# Altium project PCB_Project_1.3.PrjPcb
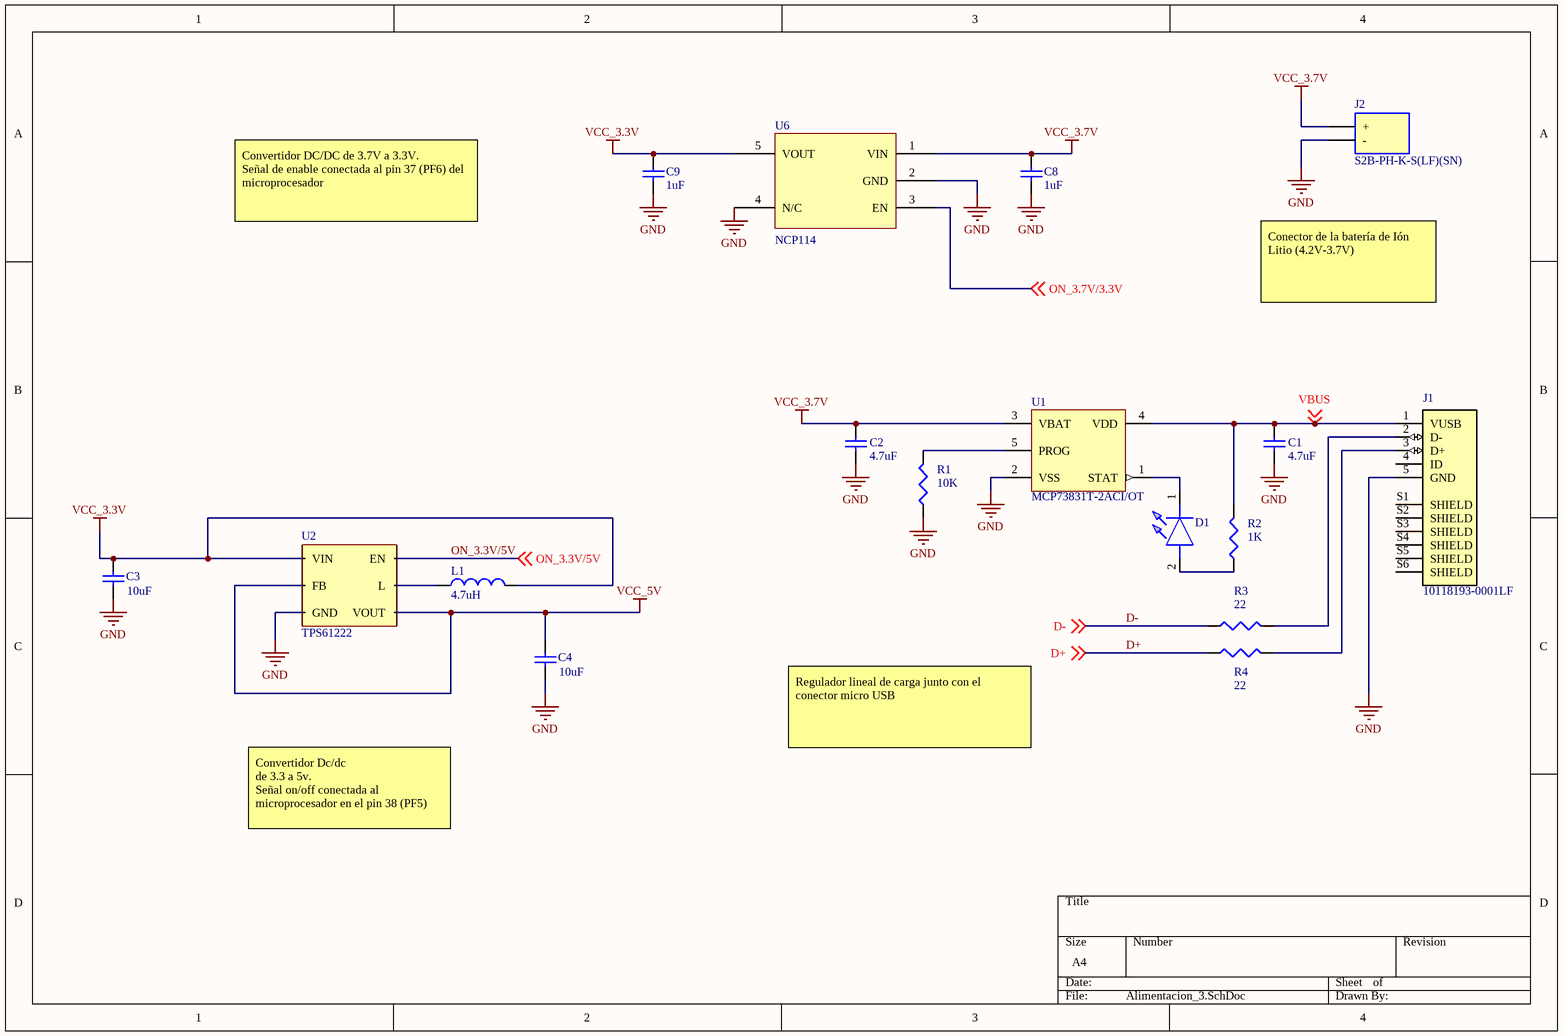
[diagram p0: Alimentacion_3.SchDoc]
3 sheets, 43 parts. Net scope: global (net labels, ports and power ports of the same name join across sheets).
Board file: Bicimaps_3.PcbDoc
Sheets:
  Alimentacion_3.SchDoc
  Procesador_3.SchDoc
  Sensores_3.SchDoc

## Sheet Alimentacion_3.SchDoc
size A4

### Parts
C1  value 4.7uF  [0603]  (hidden comment: Cap)
C2  value 4.7uF  [0603]  (hidden comment: Cap)
C3  value 10uF  [0603]  (hidden comment: Cap)
C4  value 10uF  [0603]  (hidden comment: Cap)
C8  value 1uF  [0603]  (hidden comment: Cap)
C9  value 1uF  [0603]  (hidden comment: Cap)
D1  150060GS75000  [LEDC1608X80N]  (value not drawn)
J1  10118193-0001LF  [FCI_10118193-0001LF_10118193-0001LF(Primary)]
J2  S2B-PH-K-S(LF)(SN)  [S2B_Lipo_Header]
L1  value 4.7uH  [0603]  (hidden comment: Inductor)
R1  value 10K  [0603]  (hidden comment: Res3)
R2  value 1K  [0603]  (hidden comment: Res3)
R3  value 22  [0603]  (hidden comment: Res3)
R4  value 22  [0603]  (hidden comment: Res3)
U1  MCP73831T-2ACI/OT  [SOT-23-OT5_N]
U2  TPS61222  [TPS61222DCK]
U6  NCP114  [NCP114-TSOP5]

### Nets
GND: C1.1 C2.1 C3.1 C4.1 C8.1 C9.1 J1.5(GND) J2.2(-) R1.1 U1.2(VSS) U2.GND U6.2(GND) U6.4(N/C)
VCC_3.3V: C3.2 C9.2 L1.2 U2.VIN U6.5(VOUT)
VCC_3.7V: C2.2 C8.2 J2.1(+) U1.3(VBAT) U6.1(VIN)
VCC_5V: C4.2 U2.FB U2.VOUT
D+: R4.1 ; off-sheet D+
D-: R3.1 ; off-sheet D-
ON_3.3V/5V: U2.EN ; off-sheet ON_3.3V/5V
ON_3.7V/3.3V: U6.3(EN) ; off-sheet ON_3.7V/3.3V  [project net POWER_BT]
VBUS: C1.2 J1.1(VUSB) R2.2 U1.4(VDD) ; off-sheet VBUS
NetD1_1: D1.1(K) U1.1(STAT)
NetD1_2: D1.2(A) R2.1
NetJ1_2: J1.2(D-) R3.2
NetJ1_3: J1.3(D+) R4.2
NetL1_1: L1.1 U2.L
NetR1_2: R1.2 U1.5(PROG)

Not connected (* = marked no-connect by the designer): J1 4(ID) S1(SHIELD) S2(SHIELD) S3(SHIELD) S4(SHIELD) S5(SHIELD) S6(SHIELD)

### Notes on the sheet
- Convertidor DC/DC de 3.7V a 3.3V.
  Señal de enable conectada al pin 37 (PF6) del microprocesador
- Conector de la batería de Ión Litio (4.2V-3.7V)
- Regulador lineal de carga junto con el conector micro USB
- Convertidor Dc/dc
  de 3.3 a 5v.
  Señal on/off conectada al microprocesador en el pin 38 (PF5)

### Library data of the parts
C1-C4 C8 C9 = Cap_0603: Capacitor; Published: 8-Jun-2000; LatestRevisionDate: 17-Jul-2002; LatestRevisionNote: Re-released for DXP Platform.; PackageReference: RAD-0.3; Publisher: Altium Limited; PackageDescription: Radial Cap, Thru-Hole; 2 Leads; 0.3 in Pin Spacing; Supplier 1: RSComponents; Supplier 2: Digi-Key
  C1 C2: Supplier Part Number 1: 6911155; Supplier Part Number 2: 399-5503-6-ND
  C3 C4: Supplier Part Number 1: 7882893; Supplier Part Number 2: 445-7486-1-ND
  C8 C9: Supplier Part Number 1: 4612708; Supplier Part Number 2: 478-1251-1-ND
D1 = 150060GS75000: Wurth Elektronik WL-SMCW 520 nm Green LED, 1608 (0603) Clear SMD package; Geometry.Height: 0.8mm; Manufacturer_Name: Wurth Elektronik; Manufacturer_Part_Number: 150060GS75000; RS Part Number: 8154209P; RS Price/Stock: http://uk.rs-online.com/web/p/products/8154209P; Arrow Part Number: 150060GS75000; Arrow Price/Stock: http://uk.rs-online.com/web/p/products/8154209P; Datasheet Link: https://componentsearchengine.com/Datasheets/2/150060GS75000.pdf; Supplier 1: RSComponents; Supplier Part Number 1: 6973715; Supplier 2: Digi-Key; Supplier Part Number 2: 732-4971-1-ND
J1 = 10118193-0001LF: Single Port 5 Contact Shielded SMT MICRO USB B-Type Receptacle; MF: Amphenol FCI; Availability: Unavailable; Package: None; Price: None; SnapEDA_Link: https://www.snapeda.com/parts/10118193-0001LF/Amphenol%20FCI/view-part/?ref=snap; MP: 10118193-0001LF; Value: *; Supplier 1: RSComponents; Supplier Part Number 1: 8632989; Supplier 2: Digi-Key; Supplier Part Number 2: 609-4616-1-ND
J2 = S2B-PH-K-S(LF)(SN): PH-2.0mm Header side entry 2 way JST PH Series, Series Number S2B, 2mm Pitch 2 Way 1 Row Right Angle PCB Header, Through Hole Termination, 2A; Manufacturer_Name: JST (JAPAN SOLDERLESS TERMINALS); Geometry.Height: 6mm; Manufacturer_Part_Number: S2B-PH-K-S(LF)(SN); RS Part Number: 1724889; RS Price/Stock: http://uk.rs-online.com/web/p/products/1724889; Arrow Part Number: S2B-PH-K-S(LF)(SN); Arrow Price/Stock: https://www.arrow.com/en/products/s2b-ph-k-s-lf-sn/jst-manufacturing; Datasheet Link: http://uk.rs-online.com/web/p/products/8201494; Supplier 1: RSComponents; Supplier Part Number 1: 8201494; Supplier 2: Digi-Key; Supplier Part Number 2: 455-1719-ND
L1 = Inductor: Code_IEC: 1005; Published: 8-Jun-2000; LatestRevisionDate: 29-May-2009; LatestRevisionNote: IPC-7351 Footprint Added.; PackageReference: 0402-A; Publisher: Altium Limited; PackageDescription: Chip Inductor; Code_JEITA: 0402; Supplier 1: RSComponents; Supplier Part Number 1: 7754697; Supplier 2: Digi-Key; Supplier Part Number 2: 445-3607-1-ND
R1-R4 = Res3: Resistor; Published: 8-Jun-2000; LatestRevisionDate: 29-May-2009; LatestRevisionNote: IPC-7351 Footprint Added.; PackageReference: J1-0603; Publisher: Altium Limited; PackageDescription: Chip Resistor; Supplier 1: RSComponents; Supplier 2: Digi-Key
  R1: Supplier Part Number 1: 1251173; Supplier Part Number 2: P10.0KHDKR-ND
  R2: Supplier Part Number 1: 8145889; Supplier Part Number 2: P1.00KHCT-ND
  R3 R4: Supplier Part Number 1: 7408928; Supplier Part Number 2: P22GCT-ND
U1 = MCP73831T-2ACI/OT: Miniature Single-Cell, Fully Integrated Li-Ion, Li-Polymer Charge Management Controller, 4.2V, 5-Pin SOT-23, Industrial Temperature, Tape and Reel; Published: 29-Jan-2009; LatestRevisionDate: 27-Nov-2009; LatestRevisionNote: Updated to datasheet revision E, Sep-2008; DatasheetVersion: revE, Sep-2008; PackageVersion: revBB, Aug-2009; PackageReference: SOT-23-OT5; Publisher: Altium Limited; PackageDescription: 5-Lead Plastic Small Outline Transistor (OT) [SOT-23]; Code_IPC: SOT23-5; ComponentLink1Description: Datasheet; ComponentLink1URL: http://ww1.microchip.com/downloads/en/DeviceDoc/21984e.pdf; ComponentLink2Description: Packaging Specification; ComponentLink2URL: http://www.microchip.com/stellent/groups/techpub_sg/documents/packagingspec/en012702.pdf; ComponentLink3Description: Microchip.com Home; ComponentLink3URL: http://www.microchip.com/; Supplier 1: RSComponents; Supplier Part Number 1: 7386360; Supplier 2: Digi-Key; Supplier Part Number 2: MCP73831T-2ATI/OTCT-ND
U2 = TPS61222: Supplier 1: RSComponents; Supplier Part Number 1: 8123647; Supplier 2: Digi-Key; Supplier Part Number 2: 296-24172-1-ND
U6 = NCP114: Supplier 1: RSComponents; Supplier Part Number 1: 1263178; Supplier 2: Digi-Key; Supplier Part Number 2: NCP114ASN330T1GOSCT-ND

## Sheet Procesador_3.SchDoc
size A4
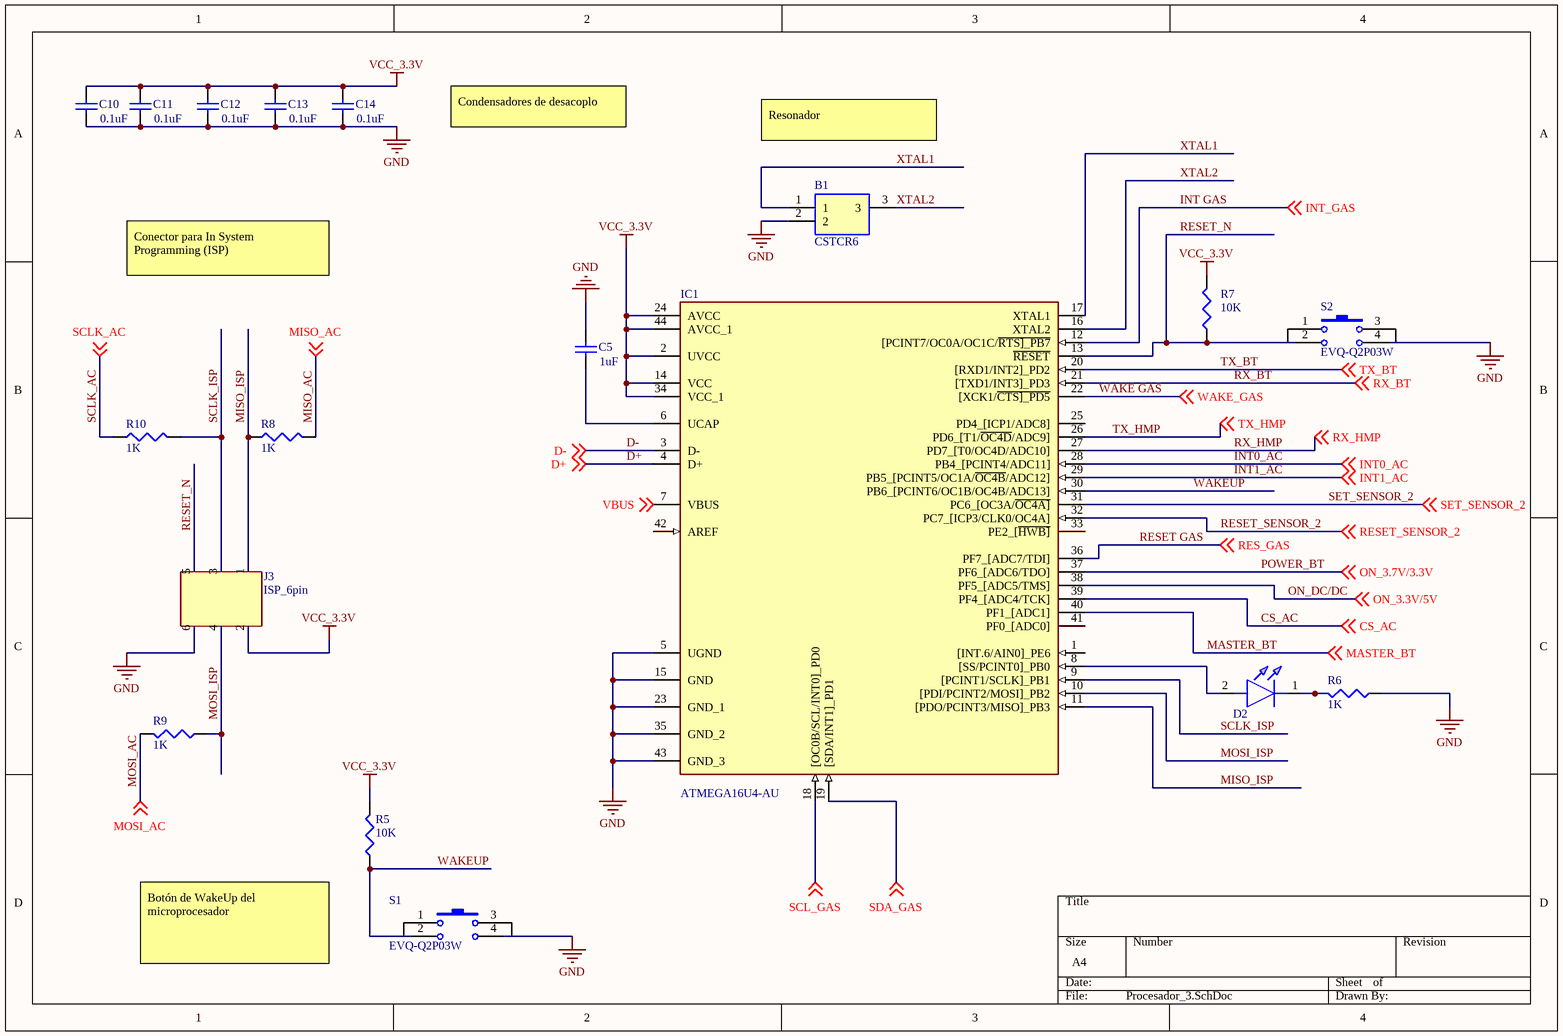
[diagram p1: Procesador_3.SchDoc]

### Parts
B1  CSTCR6  [CSTCR6M00G53]
C5  value 1uF  [0603]  (hidden comment: Cap)
C10  value 0.1uF  [0603]  (hidden comment: Cap)
C11  value 0.1uF  [0603]  (hidden comment: Cap)
C12  value 0.1uF  [0603]  (hidden comment: Cap)
C13  value 0.1uF  [0603]  (hidden comment: Cap)
C14  value 0.1uF  [0603]  (hidden comment: Cap)
D2  150060GS75000  [LEDC1608X80N]  (value not drawn)
IC1  ATMEGA16U4-AU  [ATMEGA 16U4]
J3  ISP_6pin  [ISP_6PIN]
R5  value 10K  [0603]  (hidden comment: Res3)
R6  value 1K  [0603]  (hidden comment: Res3)
R7  value 10K  [0603]  (hidden comment: Res3)
R8  value 1K  [0603]  (hidden comment: Res3)
R9  value 1K  [0603]  (hidden comment: Res3)
R10  value 1K  [0603]  (hidden comment: Res3)
S1  EVQ-Q2P03W  [EVQ-Q2P03W]
S2  EVQ-Q2P03W  [EVQ-Q2P03W]

### Nets
GND: B1.2 C5.2 C10.1 C11.1 C12.1 C13.1 C14.1 IC1.5(UGND) IC1.15(GND) IC1.23(GND_1) IC1.35(GND_2) IC1.43(GND_3) J3.6 R6.1 S1.4 S2.4
VCC_3.3V: C10.2 C11.2 C12.2 C13.2 C14.2 IC1.2(UVCC) IC1.14(VCC) IC1.24(AVCC) IC1.34(VCC_1) IC1.44(AVCC_1) J3.2 R5.2 R7.2
CS_AC: IC1.39(PF4_[ADC4/TCK]) ; off-sheet CS_AC
D+: IC1.4(D+) ; off-sheet D+
D-: IC1.3(D-) ; off-sheet D-
INT0_AC: IC1.28(PB4_[PCINT4/ADC11]) ; off-sheet INT0_AC
INT1_AC: IC1.29(PB5_[PCINT5/OC1A/~{OC4B}/ADC12]) ; off-sheet INT1_AC
INT GAS: IC1.12([PCINT7/OC0A/OC1C/~{RTS]_PB7}) ; off-sheet INT_GAS  [also labelled INT_GAS]
MASTER_BT: IC1.40(PF1_[ADC1]) ; off-sheet MASTER_BT
MISO_AC: R8.2 ; off-sheet MISO_AC
MISO_ISP: IC1.11([PDO/PCINT3/MISO]_PB3) J3.1 R8.1
MOSI_AC: R9.2 ; off-sheet MOSI_AC
MOSI_ISP: IC1.10([PDI/PCINT2/MOSI]_PB2) J3.4 R9.1
ON_3.3V/5V: IC1.38(PF5_[ADC5/TMS]) ; off-sheet ON_3.3V/5V  [also labelled ON_DC/DC]
POWER_BT: IC1.37(PF6_[ADC6/TDO]) ; off-sheet ON_3.7V/3.3V  [also labelled ON_3.7V/3.3V]
RESET GAS: IC1.36(PF7_[ADC7/TDI]) ; off-sheet RES_GAS  [also labelled RES_GAS]
RESET_N: IC1.13(~{RESET}) J3.5 R7.1 S2.2
RESET_SENSOR_2: IC1.32(PC7_[ICP3/CLK0/OC4A]) ; off-sheet RESET_SENSOR_2
RX_BT: IC1.21([TXD1/INT3]_PD3) ; off-sheet RX_BT
RX_HMP: IC1.27(PD7_[T0/OC4D/ADC10]) ; off-sheet RX_HMP
SCL_GAS: IC1.18([OC0B/SCL/INT0]_PD0) ; off-sheet SCL_GAS
SCLK_AC: R10.1 ; off-sheet SCLK_AC
SCLK_ISP: IC1.9([PCINT1/SCLK]_PB1) J3.3 R10.2
SDA_GAS: IC1.19([SDA/INT1]_PD1) ; off-sheet SDA_GAS
SET_SENSOR_2: IC1.31(PC6_[OC3A/~{OC4A]}) ; off-sheet SET_SENSOR_2
TX_BT: IC1.20([RXD1/INT2]_PD2) ; off-sheet TX_BT
TX_HMP: IC1.26(PD6_[T1/~{OC4D}/ADC9]) ; off-sheet TX_HMP
VBUS: IC1.7(VBUS) ; off-sheet VBUS
WAKE GAS: IC1.22([XCK1/~{CTS]_PD5}) ; off-sheet WAKE_GAS  [also labelled WAKE_GAS]
WAKEUP: IC1.30(PB6_[PCINT6/OC1B/OC4B/ADC13]) R5.1 S1.2
XTAL1: B1.1 IC1.17(XTAL1)
XTAL2: B1.3 IC1.16(XTAL2)
NetC5_1: C5.1 IC1.6(UCAP)
NetD2_1: D2.1(K) R6.2
NetD2_2: D2.2(A) IC1.8([SS/PCINT0]_PB0)

Not connected (* = marked no-connect by the designer): IC1 1([INT.6/AIN0]_PE6) 25(PD4_[ICP1/ADC8]) 33(PE2_[~{HWB]}) 41(PF0_[ADC0]) 42(AREF); S1 1 3; S2 1 3

### Notes on the sheet
- Condensadores de desacoplo
- Resonador
- Conector para In System Programming (ISP)
- (near R5) Botón de WakeUp del microprocesador

### Library data of the parts
B1 = CSTCE16M0V53C-R0: SMD Ceramic Resonator 16 MHz 15PF CSTCE16M0V53C-R0, Ceramic Resonator, 16MHz Expander 15pF, 4-Pin, 3.2 x 1.3 x 0.9mm; Manufacturer_Name: Murata Electronics; Geometry.Height: 1mm; Mouser Part Number: 81-CSTCE16M0V53C-R0; Manufacturer_Part_Number: CSTCE16M0V53C-R0; Datasheet Link: https://componentsearchengine.com/Datasheets/1/CSTCE16M0V53C-R0.pdf; Supplier 1: RSComponents; Supplier Part Number 1: 7926530; Supplier 2: Digi-Key; Supplier Part Number 2: 490-1204-1-ND
C5 C10-C14 = Cap_0603: Capacitor; Published: 8-Jun-2000; LatestRevisionDate: 17-Jul-2002; LatestRevisionNote: Re-released for DXP Platform.; PackageReference: RAD-0.3; Publisher: Altium Limited; PackageDescription: Radial Cap, Thru-Hole; 2 Leads; 0.3 in Pin Spacing; Supplier 1: RSComponents; Supplier 2: Digi-Key
  C5: Supplier Part Number 1: 4612708; Supplier Part Number 2: 478-1251-1-ND
  C10: Supplier Part Number 1: 147538; Supplier Part Number 2: 399-1281-1-ND
  C11-C14: Supplier Part Number 1: 8015205; Supplier Part Number 2: 399-1095-1-ND
D2 = 150060GS75000: as D1 on sheet Alimentacion_3; Manufacturer_Name: Wurth Elektronik; Manufacturer_Part_Number: 150060GS75000; RS Part Number: 8154209P; RS Price/Stock: http://uk.rs-online.com/web/p/products/8154209P; Arrow Part Number: 150060GS75000; Arrow Price/Stock: http://uk.rs-online.com/web/p/products/8154209P; Datasheet Link: https://componentsearchengine.com/Datasheets/2/150060GS75000.pdf; Supplier 1: RSComponents; Supplier Part Number 1: 6973715; Supplier 2: Digi-Key; Supplier Part Number 2: 732-4971-1-ND
IC1 = ATMEGA16U4-AU: Integrated Circuit; Manufacturer_Name: Microchip; Datasheet Link: http://www.atmel.com/images/atmel-7766-8-bit-avr-atmega16u4-32u4_summary.pdf; Height: 1.2mm; Manufacturer_Part_Number: ATMEGA16U4-AU; Supplier 1: RSComponents; Supplier Part Number 1: 1773649; Supplier 2: Digi-Key; Supplier Part Number 2: ATMEGA16U4-AU-ND
R5-R10 = Res3: Resistor; Published: 8-Jun-2000; LatestRevisionDate: 29-May-2009; LatestRevisionNote: IPC-7351 Footprint Added.; PackageReference: J1-0603; Publisher: Altium Limited; PackageDescription: Chip Resistor; Supplier 1: RSComponents; Supplier 2: Digi-Key
  R5 R7: Supplier Part Number 1: 1251173; Supplier Part Number 2: P10.0KHDKR-ND
  R6 R8-R10: Supplier Part Number 1: 8145889; Supplier Part Number 2: P1.00KHCT-ND
S1 S2 = EVQ-Q2P03W: Tactile 3.1 heigth; Manufacturer_Part_Number: EVQP2602W; Vendor: Panasonic; Built_By: EMA_UL_Team; C: Copyright (C) 2015 Accelerated Designs. All rights reserved; RefDes: RefDes; Type: DEV; Value: Value; Supplier 1: RSComponents; Supplier Part Number 1: 7561858; Supplier 2: Digi-Key; Supplier Part Number 2: P12949SCT-ND
J3 = ISP_6pin: Supplier 1: Mouser; Supplier Part Number 1: 571-5-146130-2; Supplier 2: Digi-Key; Supplier Part Number 2: 5-146130-2-ND

## Sheet Sensores_3.SchDoc
size A4
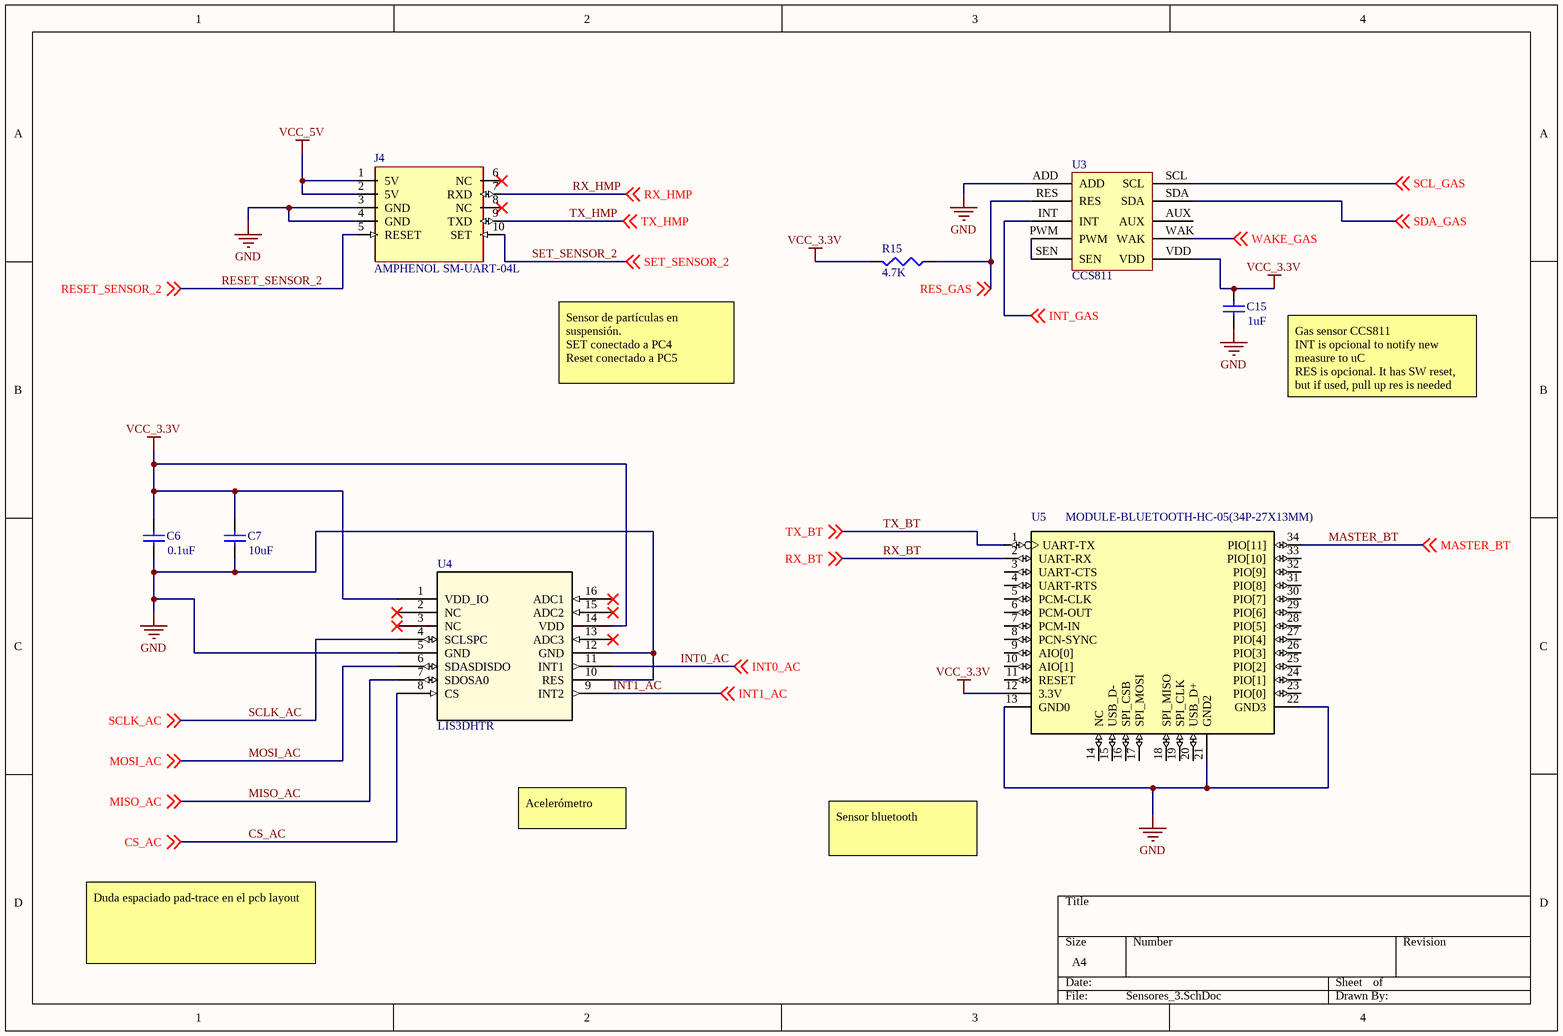
[diagram p2: Sensores_3.SchDoc]

### Parts
C6  value 0.1uF  [0603]  (hidden comment: Cap)
C7  value 10uF  [0603]  (hidden comment: Cap)
C15  value 1uF  [0603]  (hidden comment: Cap)
J4  AMPHENOL SM-UART-04L  [PM SENSOR]
R15  value 4.7K  [0603]  (hidden comment: Res3)
U3  CCS811  [CCS811]
U4  LIS3DHTR  [LIS3DHTR]
U5  MODULE-BLUETOOTH-HC-05(34P-27X13MM)  [HC-05]

### Nets
GND: C6.1 C7.1 C15.1 J4.3(GND) J4.4(GND) U3.ADD U4.5(GND) U4.10(RES) U4.12(GND) U5.13(GND0) U5.21(GND2) U5.22(GND3)
VCC_3.3V: C6.2 C7.2 C15.2 R15.2 U3.VDD U4.1(VDD_IO) U4.14(VDD) U5.12(3.3V)
VCC_5V: J4.1(5V) J4.2(5V)
CS_AC: U4.8(CS) ; off-sheet CS_AC
INT0_AC: U4.11(INT1) ; off-sheet INT0_AC
INT1_AC: U4.9(INT2) ; off-sheet INT1_AC
INT_GAS: U3.INT ; off-sheet INT_GAS  [project net INT GAS]
MASTER_BT: U5.34(PIO[11]) ; off-sheet MASTER_BT
MISO_AC: U4.7(SDOSA0) ; off-sheet MISO_AC
MOSI_AC: U4.6(SDASDISDO) ; off-sheet MOSI_AC
RES_GAS: R15.1 U3.RES ; off-sheet RES_GAS  [project net RESET GAS]
RESET_SENSOR_2: J4.5(RESET) ; off-sheet RESET_SENSOR_2
RX_BT: U5.2(UART-RX) ; off-sheet RX_BT
RX_HMP: J4.7(RXD) ; off-sheet RX_HMP
SCL_GAS: U3.SCL ; off-sheet SCL_GAS
SCLK_AC: U4.4(SCLSPC) ; off-sheet SCLK_AC
SDA_GAS: U3.SDA ; off-sheet SDA_GAS
SET_SENSOR_2: J4.10(SET) ; off-sheet SET_SENSOR_2
TX_BT: U5.1(UART-TX) ; off-sheet TX_BT
TX_HMP: J4.9(TXD) ; off-sheet TX_HMP
WAKE_GAS: U3.WAK ; off-sheet WAKE_GAS  [project net WAKE GAS]
NetU3_PWM: U3.PWM U3.SEN

Not connected (* = marked no-connect by the designer): J4 6(NC)* 8(NC)*; U3 AUX; U4 2(NC)* 3(NC)* 13(ADC3)* 15(ADC2)* 16(ADC1)*; U5 3(UART-CTS) 4(UART-RTS) 5(PCM-CLK) 6(PCM-OUT) 7(PCM-IN) 8(PCN-SYNC) 9(AIO[0]) 10(AIO[1]) 11(RESET) 14(NC) 15(USB_D-) 16(SPI_CSB) 17(SPI_MOSI) 18(SPI_MISO) 19(SPI_CLK) 20(USB_D+) 23(PIO[0]) 24(PIO[1]) 25(PIO[2]) 26(PIO[3]) 27(PIO[4]) 28(PIO[5]) 29(PIO[6]) 30(PIO[7]) 31(PIO[8]) 32(PIO[9]) 33(PIO[10])

### Notes on the sheet
- Sensor de partículas en suspensión.                                 SET conectado a PC4
  Reset conectado a PC5
- Gas sensor CCS811
  INT is opcional to notify new measure to uC
  RES is opcional. It has SW reset, but if used, pull up res is needed
- Acelerómetro
- Sensor bluetooth
- Duda espaciado pad-trace en el pcb layout

### Library data of the parts
C6 C7 C15 = Cap_0603: Capacitor; Published: 8-Jun-2000; LatestRevisionDate: 17-Jul-2002; LatestRevisionNote: Re-released for DXP Platform.; PackageReference: RAD-0.3; Publisher: Altium Limited; PackageDescription: Radial Cap, Thru-Hole; 2 Leads; 0.3 in Pin Spacing; Supplier 1: RSComponents; Supplier 2: Digi-Key
  C6: Supplier Part Number 1: 8015205; Supplier Part Number 2: 399-1095-1-ND
  C7: Supplier Part Number 1: 7882893; Supplier Part Number 2: 445-7486-1-ND
  C15: Supplier Part Number 1: 4612708; Supplier Part Number 2: 478-1251-1-ND
J4 = AMPHENOL: Supplier 1: Mouser; Supplier Part Number 1: 527-SM-UART-04L; Supplier 2: Digi-Key; Supplier Part Number 2: 235-1590-ND; Supplier 3: RSComponents; Supplier Part Number 3: 7679066; Supplier 4: Digi-Key; Supplier Part Number 4: SAM9874-ND
R15 = Res3: Resistor; Published: 8-Jun-2000; LatestRevisionDate: 29-May-2009; LatestRevisionNote: IPC-7351 Footprint Added.; PackageReference: J1-0603; Publisher: Altium Limited; PackageDescription: Chip Resistor; Supplier 1: RSComponents; Supplier Part Number 1: 8206865; Supplier 2: Digi-Key; Supplier Part Number 2: P4.70KHCT-ND
U4 = LIS3DHTR: Imported; Vendor: STMicroelectronics; Built_By: EMA_UL_Team; C: Copyright (C) 2015 Accelerated Designs. All rights reserved; Manufacturer_Part_Number: LIS3DHTR; RefDes: RefDes; Type: DEV; Value: Value; Supplier 1: RSComponents; Supplier Part Number 1: 7931364; Supplier 2: Digi-Key; Supplier Part Number 2: 497-10613-6-ND
U5 = HC-05 (Bluetooth module): Modulo bluetooth, 34 pin; MF: Texas Instruments; MP: HC05; Package: None; Availability: Unavailable; Price: None; SnapEDA_Link: https://www.snapeda.com/parts/HC05/Texas%20Instruments/view-part/?ref=snap; Value: *
U3 = CCS811: Supplier 1: Mouser; Supplier Part Number 1: 985-CCS811B-JOPR5K; Supplier 2: Digi-Key; Supplier Part Number 2: CCS811B-JOPR5KCT-ND

## Nets that join several sheets
GND: Alimentacion_3 (13 pins), Procesador_3 (16 pins), Sensores_3 (12 pins)
VCC_3.3V: Alimentacion_3 (5 pins), Procesador_3 (13 pins), Sensores_3 (8 pins)
VCC_5V: Alimentacion_3 (C4.2 U2.FB U2.VOUT), Sensores_3 (J4.1 J4.2)
CS_AC: Procesador_3 (IC1.39), Sensores_3 (U4.8)
D+: Alimentacion_3 (R4.1), Procesador_3 (IC1.4)
D-: Alimentacion_3 (R3.1), Procesador_3 (IC1.3)
INT0_AC: Procesador_3 (IC1.28), Sensores_3 (U4.11)
INT1_AC: Procesador_3 (IC1.29), Sensores_3 (U4.9)
INT GAS: Procesador_3 (IC1.12), Sensores_3 (U3.INT)
MASTER_BT: Procesador_3 (IC1.40), Sensores_3 (U5.34)
MISO_AC: Procesador_3 (R8.2), Sensores_3 (U4.7)
MOSI_AC: Procesador_3 (R9.2), Sensores_3 (U4.6)
ON_3.3V/5V: Alimentacion_3 (U2.EN), Procesador_3 (IC1.38)
POWER_BT: Alimentacion_3 (U6.3), Procesador_3 (IC1.37)
RESET GAS: Procesador_3 (IC1.36), Sensores_3 (R15.1 U3.RES)
RESET_SENSOR_2: Procesador_3 (IC1.32), Sensores_3 (J4.5)
RX_BT: Procesador_3 (IC1.21), Sensores_3 (U5.2)
RX_HMP: Procesador_3 (IC1.27), Sensores_3 (J4.7)
SCL_GAS: Procesador_3 (IC1.18), Sensores_3 (U3.SCL)
SCLK_AC: Procesador_3 (R10.1), Sensores_3 (U4.4)
SDA_GAS: Procesador_3 (IC1.19), Sensores_3 (U3.SDA)
SET_SENSOR_2: Procesador_3 (IC1.31), Sensores_3 (J4.10)
TX_BT: Procesador_3 (IC1.20), Sensores_3 (U5.1)
TX_HMP: Procesador_3 (IC1.26), Sensores_3 (J4.9)
VBUS: Alimentacion_3 (C1.2 J1.1 R2.2 U1.4), Procesador_3 (IC1.7)
WAKE GAS: Procesador_3 (IC1.22), Sensores_3 (U3.WAK)